# EAGLE design keyboard (EAGLE 9.0.0)
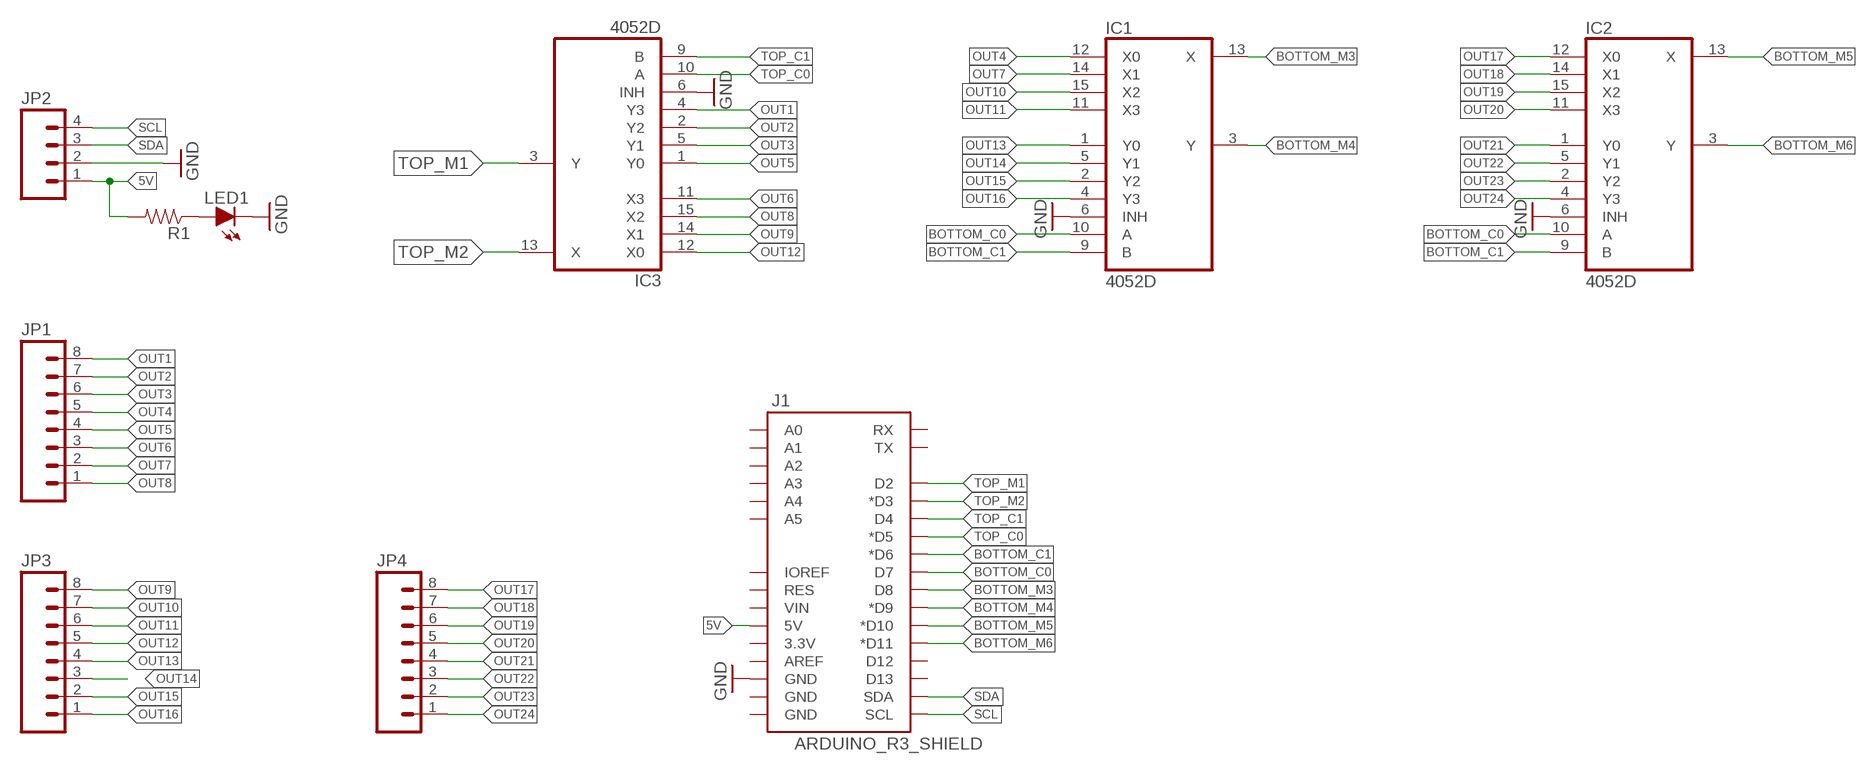
[diagram p0: schematic, sheet 1]

## Parts
IC1  4052D  [SO16]
IC2  4052D  [SO16]
IC3  4052D  [SO16]
J1  ARDUINO_R3_SHIELD  [UNO_R3_SHIELD]
JP1  M08  [1X08]
JP2  M04  [1X04]
JP3  M08  [1X08]
JP4  M08  [1X08]
LED1  LED-5MM  [LED-5MM]
R1  RESISTORPTH-1/2W  [AXIAL-0.5]

## Nets
5V: J1.5V JP2.1 R1.P$2
BOTTOM_C0: IC1.10(A) IC2.10(A) J1.D7
BOTTOM_C1: IC1.9(B) IC2.9(B) J1.D6(*D6)
BOTTOM_M3: IC1.13(X) J1.D8
BOTTOM_M4: IC1.3(Y) J1.D9(*D9)
BOTTOM_M5: IC2.13(X) J1.D10(*D10)
BOTTOM_M6: IC2.3(Y) J1.D11(*D11)
GND: IC1.6(INH) IC2.6(INH) IC3.6(INH) J1.GND@2(GND) JP2.2 LED1.K(C)
N$1: LED1.A R1.P$1
OUT1: IC3.4(Y3) JP1.8
OUT2: IC3.2(Y2) JP1.7
OUT3: IC3.5(Y1) JP1.6
OUT4: IC1.12(X0) JP1.5
OUT5: IC3.1(Y0) JP1.4
OUT6: IC3.11(X3) JP1.3
OUT7: IC1.14(X1) JP1.2
OUT8: IC3.15(X2) JP1.1
OUT9: IC3.14(X1) JP3.8
OUT10: IC1.15(X2) JP3.7
OUT11: IC1.11(X3) JP3.6
OUT12: IC3.12(X0) JP3.5
OUT13: IC1.1(Y0) JP3.4
OUT14: IC1.5(Y1) JP3.3
OUT15: IC1.2(Y2) JP3.2
OUT16: IC1.4(Y3) JP3.1
OUT17: IC2.12(X0) JP4.8
OUT18: IC2.14(X1) JP4.7
OUT19: IC2.15(X2) JP4.6
OUT20: IC2.11(X3) JP4.5
OUT21: IC2.1(Y0) JP4.4
OUT22: IC2.5(Y1) JP4.3
OUT23: IC2.2(Y2) JP4.2
OUT24: IC2.4(Y3) JP4.1
SCL: J1.SCL JP2.4
SDA: J1.SDA JP2.3
TOP_C0: IC3.10(A) J1.D5(*D5)
TOP_C1: IC3.9(B) J1.D4
TOP_M1: IC3.3(Y) J1.D2
TOP_M2: IC3.13(X) J1.D3(*D3)
Unconnected: J1.3.3V J1.A0 J1.A1 J1.A2 J1.A3 J1.A4 J1.A5 J1.AREF J1.D12 J1.D13 J1.GND@0(GND) J1.GND@1(GND) J1.IOREF J1.RES J1.RX J1.TX J1.VIN

## Power pins joined to a net without a drawn wire
GND: IC1.8(GND) IC2.8(GND) IC3.8(GND)
VCC: IC1.16(VCC) IC2.16(VCC) IC3.16(VCC)
VEE: IC1.7(VEE) IC2.7(VEE) IC3.7(VEE)

## Library data of the parts
IC1-IC3 = 40xx:4052: Dual 4-channel ANALOG MULTIPLEXER
J1 = HyTechDevices:ARDUINO_R3_SHIELD: Shield form compatible with the Arduino Uno R3. Source: Sparkfun <https://github.com/sparkfun/SparkFun-Eagle-Libraries>
JP1 JP3 JP4 = HyTechDevices:M08: Standard 8-pin 0.1" header. NOTES ON THE VARIANTS LOCK and LOCK_LONGPADS... This footprint was designed to help hold the alignment of a through-hole component (i.e. 6-pin header) while soldering it into place. You may notice that each hole has been shifted either up or down by 0.005 of an inch from it's more standard position (which is a perfectly straight line). This slight alteration caused the pins (the squares in the middle) to touch the edges of the holes. Because they are alternating, it causes a "brace" to hold the component in place. 0.005 has proven to be the perfect amount of "off-center" position when using our standard breakaway headers. Although looks a little odd when you look at the bare footprint, once you have a header in there, the alteration is very hard to notice. Also,if you push a header all the way into place, it is covered up entirely on the bottom side. This idea of altering the position of holes to aid alignment will be further integrated into the Sparkfun Library for other footprints. It can help hold any component with 3 or more connection pins. Note: The Sparkfun version includes many other packages including surface mount that may be of future interest. Source: Sparkfun <https://github.com/sparkfun/SparkFun-Eagle-Libraries>
JP2 = HyTechDevices:M04: Standard 4-pin 0.1" header. NOTES ON THE VARIANTS LOCK and LOCK_LONGPADS... This footprint was designed to help hold the alignment of a through-hole component (i.e. 6-pin header) while soldering it into place. You may notice that each hole has been shifted either up or down by 0.005 of an inch from it's more standard position (which is a perfectly straight line). This slight alteration caused the pins (the squares in the middle) to touch the edges of the holes. Because they are alternating, it causes a "brace" to hold the component in place. 0.005 has proven to be the perfect amount of "off-center" position when using our standard breakaway headers. Although looks a little odd when you look at the bare footprint, once you have a header in there, the alteration is very hard to notice. Also,if you push a header all the way into place, it is covered up entirely on the bottom side. This idea of altering the position of holes to aid alignment will be further integrated into the Sparkfun Library for other footprints. It can help hold any component with 3 or more connection pins. Note: The Sparkfun version includes many other packages including surface mount that may be of future interest. Source: Sparkfun <https://github.com/sparkfun/SparkFun-Eagle-Libraries>
LED1 = HyTechDevices:LED: Light Emitting Diode (LED) Source: Dangerous Prototypes Eagle Library <https://github.com/DangerousPrototypes/Eagle_Part_Library>
R1 = HyTechDevices:RESISTOR: Resistor Basic schematic elements and footprints for 0603, 1206, and PTH resistors.

## Board
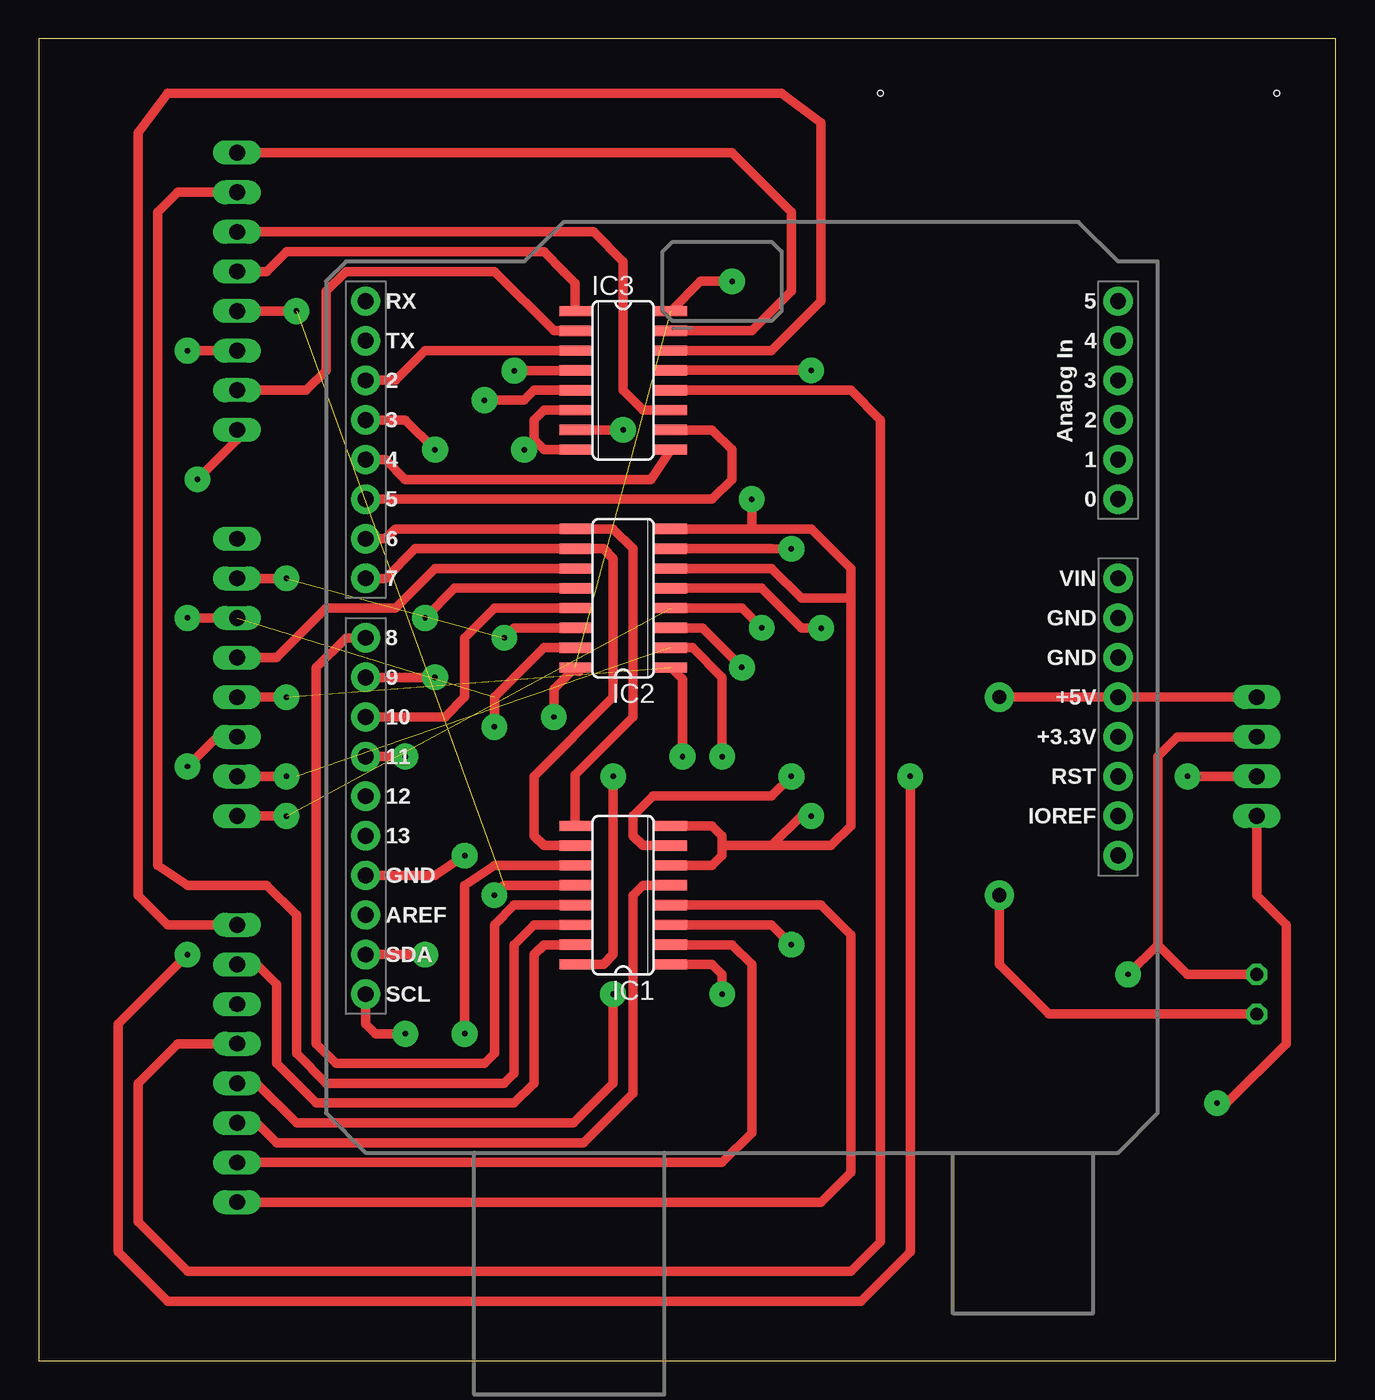
[diagram p1: board, top side]
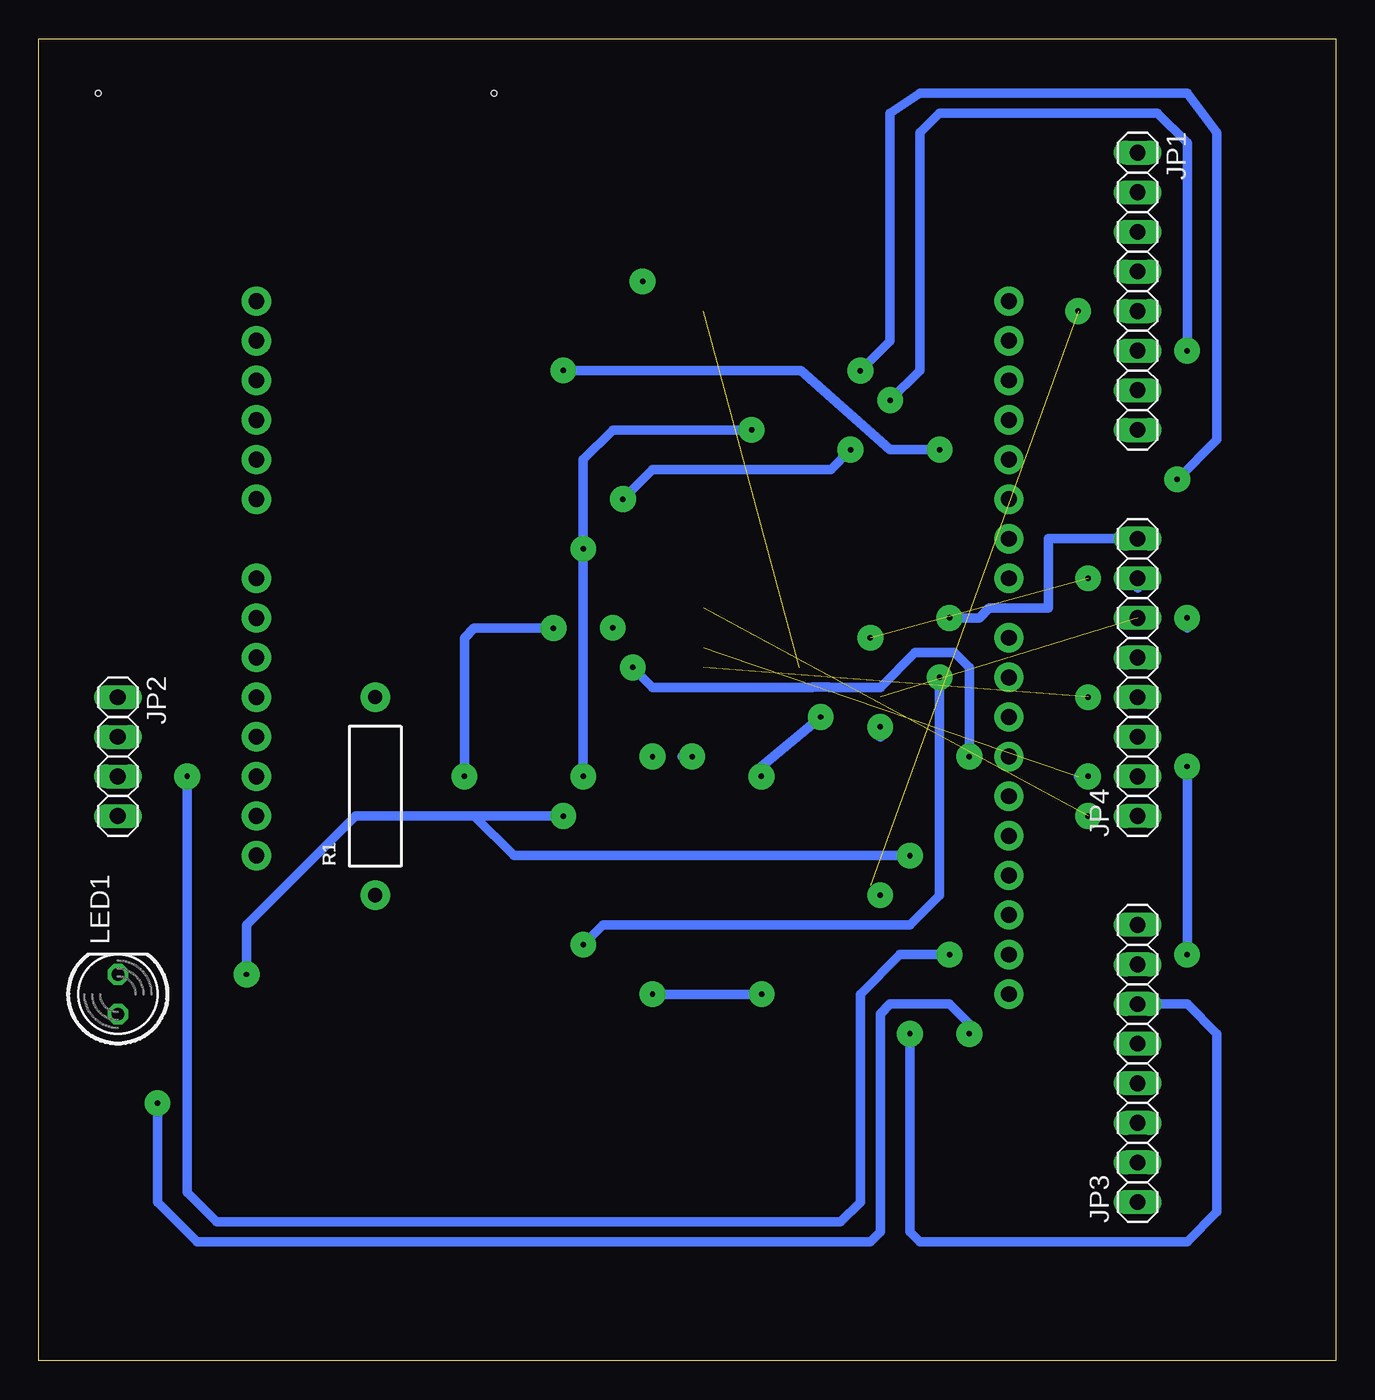
[diagram p2: board, bottom side, seen from below]

Size 83.16 x 84.76 mm. Coordinates in mm from the lower left corner, seen from the top.
Outline: 0,0 83.16,0 83.16,84.76 0,84.76 0,0
Copper layers (1*16): Top 0.035mm / dielectric 1.5mm / Bottom 0.035mm
Design rules "default": minimum track width 6mil, minimum drill 0.35mm, track to track 6mil, track to pad 6mil, pad to pad 6mil, via to via 6mil, smd to smd 6mil, copper to edge 40mil, drill to drill 6mil, minimum pad ring 10mil, minimum via ring 8mil, stop-mask expansion 4mil, vias tented up to drill 0mil, thermal gap 10mil
Holes 0.35 mm at 79.38,81.28 53.97,81.28

### Footprints (pad centres in the part's own frame; a part is rotated, then mirrored left to right if it is on the bottom)
SO16 = smd 0.66 x 2.032: 1 -4.445,-3.073; 2 -3.175,-3.073; 3 -1.905,-3.073; 4 -0.635,-3.073; 5 0.635,-3.073; 6 1.905,-3.073; 7 3.175,-3.073; 8 4.445,-3.073; 9 4.445,3.073; 10 3.175,3.073; 11 1.905,3.073; 12 0.635,3.073; 13 -0.635,3.073; 14 -1.905,3.073; 15 -3.175,3.073; 16 -4.445,3.073
UNO_R3_SHIELD = drill 1.016 pad 1.88: 3.3V 50.8,26.67; 5V 50.8,29.21; A0 50.8,41.91; A1 50.8,44.45; A2 50.8,46.99; A3 50.8,49.53; A4 50.8,52.07; A5 50.8,54.61; AREF 2.54,15.24; D2 2.54,49.53; D3 2.54,46.99; D4 2.54,44.45; D5 2.54,41.91; D6 2.54,39.37; D7 2.54,36.83; D8 2.54,33.02; D9 2.54,30.48; D10 2.54,27.94; D11 2.54,25.4; D12 2.54,22.86; D13 2.54,20.32; GND@0 50.8,31.75; GND@1 50.8,34.29; GND@2 2.54,17.78; IOREF 50.8,21.59; NC 50.8,19.05; RES 50.8,24.13; RX 2.54,54.61; SCL 2.54,10.16; SDA 2.54,12.7; TX 2.54,52.07; VIN 50.8,36.83
1X08 = drill 1.016 long: 1 -8.89,0; 2 -6.35,0; 3 -3.81,0; 4 -1.27,0; 5 1.27,0; 6 3.81,0; 7 6.35,0; 8 8.89,0
1X04 = drill 1.016 long: 1 -3.81,0; 2 -1.27,0; 3 1.27,0; 4 3.81,0
LED-5MM = drill 0.813 octagon: A -1.27,0; K 1.27,0
AXIAL-0.5 = drill 0.9 pad 1.88: P$1 -6.35,0; P$2 6.35,0

### Placement (x,y rotation side)
IC1  37.47,29.84 90 top
IC2  37.47,48.9 90 top
IC3  37.47,62.87 270 top
J1  18.42,13.34 0 top
JP1  12.7,68.58 270 bottom
JP2  78.11,38.73 270 bottom
JP3  12.7,19.05 90 bottom
JP4  12.7,43.81 90 bottom
LED1  78.11,23.5 90 bottom
R1  61.59,36.2 90 bottom

### Tracks (layer width: path | path; a pad name or v marks a point on that pad's centre or on a via)
5V
  Top 0.61: JP2.1 J1.5V R1.P$2
BOTTOM_C0
  Top 0.61: J1.D7 22.22,50.16 24.13,52.07 IC2.10 36.2,52.07 36.83,51.44 36.83,42.55 31.75,37.46 31.75,33.66 32.39,33.02 IC1.10
BOTTOM_C1
  Top 0.61: J1.D6 22.22,52.7 22.86,53.34 IC2.9 36.83,53.34 38.1,52.07 38.1,41.27 34.39,37.57 IC1.9
BOTTOM_M3
  Top 0.61: 21.59,46.35 J1.D8 19.68,46.35 17.78,44.45 17.78,20.32 19.05,19.05 28.57,19.05 29.21,19.68 29.21,27.94 30.48,29.21 IC1.13
BOTTOM_M4  (via drill 0.35 pad 1.65)
  Top 0.61: v48.26,26.67 46.99,27.94 IC1.3 | v25.4,43.81 J1.D9
  Bottom 0.61: v48.26,26.67 46.99,27.94 27.31,27.94 25.4,29.84 v25.4,43.81
BOTTOM_M5
  Top 0.61: IC2.13 29.21,48.26 27.31,46.35 27.31,42.55 26.04,41.27 J1.D10
BOTTOM_M6  (via drill 0.35 pad 1.65)
  Top 0.61: v23.5,38.73 J1.D11 | IC2.3 42.55,46.99 v45.08,44.45
  Bottom 0.61: v23.5,38.73 23.5,44.45 24.45,45.4 26.99,45.4 29.21,43.18 32.48,43.18 32.49,43.19 33.55,43.19 33.56,43.18 43.81,43.18 v45.08,44.45
GND  (via drill 0.35 pad 1.65)
  Top 0.61: IC3.6 32.39,60.96 31.75,60.32 31.75,59.05 | 31.75,59.05 32.39,58.42 IC3.8 | IC1.6 43.18,31.75 43.81,32.38 43.81,33.02 | 43.81,33.02 43.81,33.66 43.18,34.29 IC1.8 | JP2.2 73.02,40.01 71.75,38.73 71.75,26.67 | 46.99,33.02 50.8,33.02 52.07,34.29 52.07,48.9 | 46.99,33.02 43.81,33.02 | 52.07,48.9 52.07,50.8 49.53,53.34 45.72,53.34 | LED1.K 73.66,24.77 71.75,26.67 | 71.75,26.67 v69.85,24.77 | v49.53,34.92 48.89,34.92 46.99,33.02 | IC2.8 45.72,53.34 | 31.75,59.05 v31.11,58.42 | v45.71,55.24 45.72,55.23 45.72,53.34 | J1.GND@2 25.4,31.12 v27.31,32.38 | 52.07,48.9 48.89,48.9 46.99,50.8 IC2.6
  Bottom 0.61: v69.85,24.77 69.85,27.94 62.86,34.92 55.25,34.92 | 55.25,34.92 v49.53,34.92 | v31.11,58.42 32.39,57.15 43.8,57.15 v45.71,55.24 | v27.31,32.38 52.7,32.38 55.25,34.92
N$1
  Top 0.61: R1.P$1 61.59,25.4 64.77,22.23 LED1.A
OUT1  (via drill 0.35 pad 1.65)
  Top 0.61: IC3.4 34.38,63.49 v30.48,63.49 | v10.16,56.52 12.7,59.05 JP1.8
  Bottom 0.61: v30.48,63.49 28.57,65.39 28.57,80.01 26.67,81.28 9.53,81.28 7.62,78.74 7.62,59.05 v10.16,56.52
OUT2
  Top 0.61: IC3.2 33.02,66.04 29.21,69.85 19.68,69.85 18.42,68.58 18.42,63.5 17.14,62.23 JP1.7
OUT3  (via drill 0.35 pad 1.65)
  Top 0.61: IC3.5 31.75,62.23 31.11,61.6 v28.57,61.6 | v9.53,64.77 JP1.6
  Bottom 0.61: v28.57,61.6 26.67,63.5 26.67,78.1 26.67,78.74 25.4,80.01 11.43,80.01 9.53,78.1 v9.53,64.77
OUT4  (via drill 0.35 pad 1.65)  (1 unrouted)
  Top 0.61: IC1.12 29.85,30.48 v29.21,29.84 | JP1.5 15.88,67.31 v16.51,67.31
OUT5
  Top 0.61: IC3.1 34.39,69.11 33.66,69.85 32.39,71.12 15.88,71.12 14.61,69.85 JP1.4
OUT6
  Top 0.61: JP1.3 35.56,72.39 37.47,70.49 37.47,62.23 38.73,60.96 IC3.11
OUT7
  Top 0.61: IC1.14 31.75,27.94 30.48,26.67 30.48,18.41 29.85,17.78 18.42,17.78 16.51,19.68 16.51,28.58 14.61,30.48 9.53,30.48 7.62,31.75 7.62,73.66 8.89,74.93 JP1.2
OUT8
  Top 0.61: IC3.15 45.72,66.04 48.26,68.58 48.26,73.66 44.45,77.47 JP1.1 12.07,77.47
OUT9
  Top 0.61: IC3.14 46.99,64.77 50.16,67.94 50.16,79.38 47.62,81.28 8.26,81.28 6.35,78.74 6.35,29.84 8.26,27.94 JP3.8 13.34,27.94
OUT10
  Top 0.61: IC1.15 32.39,26.67 31.75,26.04 31.75,17.78 30.48,16.51 17.78,16.51 15.24,19.05 15.24,24.13 13.97,25.4 JP3.7
OUT11  (via drill 0.35 pad 1.65)
  Top 0.61: IC1.11 29.21,31.75 27.31,30.48 v27.31,20.95
  Bottom 0.61: v27.31,20.95 27.31,8.25 26.67,7.62 9.53,7.62 7.62,9.53 7.62,20.95 9.53,22.86 JP3.6
OUT12
  Top 0.61: IC3.12 52.07,62.23 53.97,60.32 53.97,7.62 52.07,5.71 9.53,5.71 6.35,8.89 6.35,17.78 8.89,20.32 JP3.5
OUT13  (via drill 0.35 pad 1.65)
  Top 0.61: JP3.4 13.97,17.78 16.51,15.24 34.29,15.24 36.83,17.78 36.83,23.48 v36.82,23.5 | v43.81,23.5 43.81,24.77 43.18,25.4 IC1.1
  Bottom 0.61: v36.82,23.5 v43.81,23.5
OUT14
  Top 0.61: IC1.5 38.73,30.48 38.1,29.84 38.1,17.14 34.92,13.97 15.24,13.97 13.97,15.24 JP3.3
OUT15
  Top 0.61: IC1.2 44.45,26.67 45.72,25.4 45.72,14.61 43.81,12.7 JP3.2
OUT16
  Top 0.61: IC1.4 50.16,29.21 52.07,27.3 52.07,12.07 50.16,10.16 JP3.1
OUT17  (via drill 0.35 pad 1.65)
  Top 0.61: IC2.12 26.67,49.53 v24.77,47.62
  Bottom 0.61: v24.77,47.62 22.86,47.62 22.22,48.26 18.42,48.26 18.42,52.7 JP4.8
OUT18  (via drill 0.35 pad 1.65)  (1 unrouted)
  Top 0.61: JP4.7 v15.88,50.16 | IC2.14 30.48,46.99 v29.85,46.35
  Bottom 0.61: JP4.7 12.7,49.53
OUT19  (via drill 0.35 pad 1.65)  (1 unrouted)
  Top 0.61: IC2.15 32.39,45.72 29.21,42.55 v29.21,40.64 | JP4.6 v9.53,47.62
  Bottom 0.61: v29.21,40.64 29.21,40.01 | v9.53,47.62 9.53,46.99
OUT20
  Top 0.61: IC2.11 25.4,50.8 22.86,48.26 18.42,48.26 15.24,45.09 JP4.5
OUT21  (via drill 0.35 pad 1.65)  (1 unrouted)
  Top 0.61: IC2.1 41.28,43.71 v41.28,38.73 | JP4.4 v15.88,42.55
  Bottom 0.61: 41.91,38.73 v41.28,38.73
OUT22  (via drill 0.35 pad 1.65)
  Top 0.61: v50.16,46.98 50.16,46.99 48.89,46.99 46.36,49.53 IC2.5 | v55.88,37.46 55.88,6.98 52.7,3.81 8.26,3.81 5.08,6.98 5.08,21.59 v9.53,26.04 | JP4.3 11.43,40.01 v9.53,38.1
  Bottom 0.61: v50.16,46.98 55.23,46.98 55.25,46.99 55.88,46.35 v55.88,37.46 | v9.53,26.04 v9.53,38.1
OUT23  (via drill 0.35 pad 1.65)  (1 unrouted)
  Top 0.61: IC2.2 41.91,45.72 43.81,43.81 v43.81,38.73 | JP4.2 v15.88,37.46
  Bottom 0.61: 16.51,37.46 v15.88,37.46
OUT24  (via drill 0.35 pad 1.65)  (1 unrouted)
  Top 0.61: IC2.4 45.08,48.26 v46.36,46.99 | JP4.1 v15.88,34.92
SCL  (via drill 0.35 pad 1.65)
  Top 0.61: JP2.4 78.11,29.84 80.01,27.94 80.01,20.32 76.2,16.51 v75.56,16.51 | J1.SCL 20.96,21.59 21.59,20.95 v23.5,20.95
  Bottom 0.61: v23.5,20.95 23.5,21.59 24.77,22.86 28.57,22.86 29.21,22.23 29.21,8.25 29.85,7.62 73.02,7.62 75.56,10.16 v75.56,16.51
SDA  (via drill 0.35 pad 1.65)
  Top 0.61: J1.SDA v24.77,26.04 | v73.66,37.46 JP2.3
  Bottom 0.61: v24.77,26.04 27.94,26.04 30.48,23.5 30.48,10.16 31.75,8.89 71.75,8.89 73.66,10.79 v73.66,37.46
TOP_C0
  Top 0.61: IC3.10 43.18,59.69 44.45,58.42 44.45,56.52 43.18,55.24 J1.D5
TOP_C1
  Top 0.61: IC3.9 39.27,56.52 23.5,56.52 22.22,57.78 J1.D4
TOP_M1
  Top 0.61: IC3.3 24.77,64.77 22.86,62.87 J1.D2
TOP_M2  (via drill 0.35 pad 1.65)
  Top 0.61: J1.D3 23.5,60.32 v25.4,58.42 | v49.53,63.51 40.55,63.51 IC3.13
  Bottom 0.61: v25.4,58.42 28.57,58.42 34.29,63.5 49.53,63.5 v49.53,63.51
VCC  (via drill 0.35 pad 1.65)  (1 unrouted)
  Top 0.61: IC2.16 34.39,44.43 | 34.39,44.43 34.64,44.18 | IC1.16 36.2,25.4 36.83,26.04 v36.83,37.46 | v33.02,41.27 33.02,43.06 34.39,44.43 | IC3.16 42.44,69.22 v44.45,69.22
  Bottom 0.61: v36.83,37.46 36.83,38.1 v33.02,41.27
VEE  (via drill 0.35 pad 1.65)
  Top 0.61: v48.26,52.06 46.98,52.07 IC2.7 | v37.47,59.69 IC3.7 | IC1.7 38.73,33.02 38.1,33.66 38.1,34.92 39.37,36.2 46.99,36.2 v48.26,37.46
  Bottom 0.61: v37.47,59.69 46.36,59.69 48.26,57.78 v48.26,52.06 v48.26,37.46